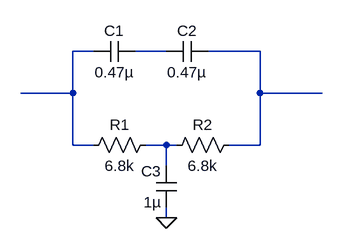
[diagram p0: schematic notch.asc]
notch.asc, the LTspice schematic file:
Version 4
SHEET 1 880 680
WIRE -32 96 -64 96
WIRE 80 96 32 96
WIRE 224 96 144 96
WIRE -64 160 -64 96
WIRE -64 160 -144 160
WIRE 224 160 224 96
WIRE 320 160 224 160
WIRE -64 240 -64 160
WIRE -32 240 -64 240
WIRE 80 240 48 240
WIRE 96 240 80 240
WIRE 224 240 224 160
WIRE 224 240 176 240
WIRE 80 272 80 240
WIRE 80 352 80 336
FLAG 80 352 0
SYMBOL cap 32 80 R90
WINDOW 0 0 32 VBottom 2
WINDOW 3 32 32 VTop 2
SYMATTR InstName C1
SYMATTR Value 0.47µ
SYMBOL cap 144 80 R90
WINDOW 0 0 32 VBottom 2
WINDOW 3 32 32 VTop 2
SYMATTR InstName C2
SYMATTR Value 0.47µ
SYMBOL res 64 224 R90
WINDOW 0 0 56 VBottom 2
WINDOW 3 32 56 VTop 2
SYMATTR InstName R1
SYMATTR Value 6.8k
SYMBOL res 192 224 R90
WINDOW 0 0 56 VBottom 2
WINDOW 3 32 56 VTop 2
SYMATTR InstName R2
SYMATTR Value 6.8k
SYMBOL cap 96 336 R180
WINDOW 0 24 56 Left 2
WINDOW 3 24 8 Left 2
SYMATTR InstName C3
SYMATTR Value 1µ

The netlist it stands for:
* notch.asc
C1 N002 N001 0.47µ
C2 N003 N002 0.47µ
R1 N004 N001 6.8k
R2 N003 N004 6.8k
C3 0 N004 1µ
.backanno
.end